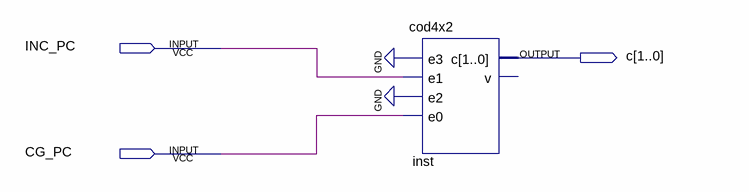
[diagram p0: schematic sheet]
// Quartus schematic controle_pc.bdf as structural Verilog: 1 symbols, 3 pins
module controle_pc (
  input  INC_PC,
  input  CG_PC,
  output [1:0] c
);

  cod4x2 inst (.e3(1'b0), .e1(INC_PC), .e2(1'b0), .e0(CG_PC), .c(c));  // open: v
endmodule
